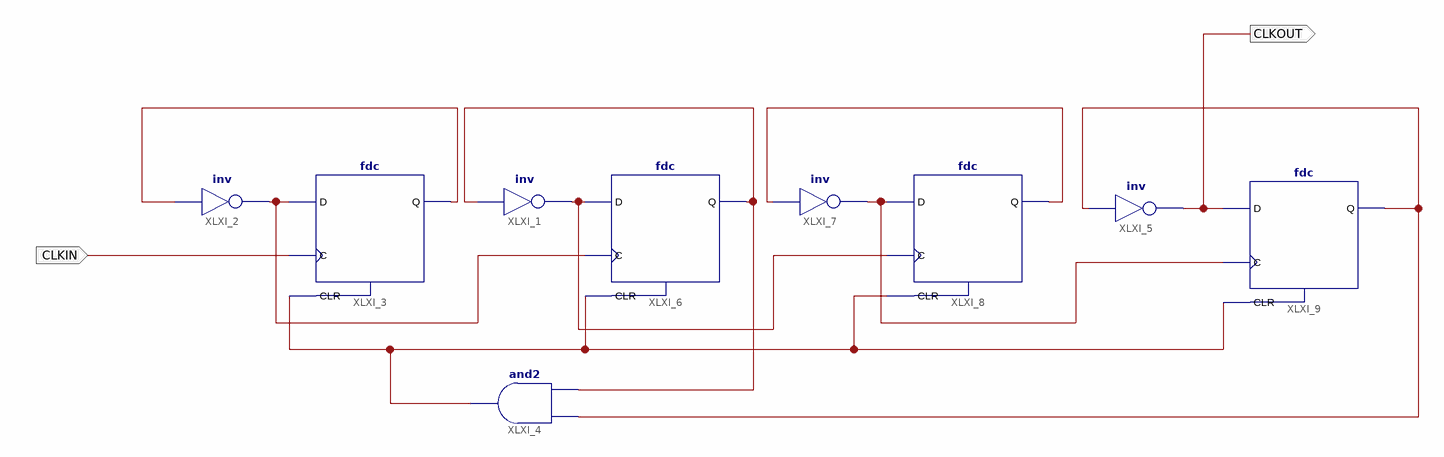
[diagram p0: schematic sheet 1]
// Xilinx ISE schematic C_DIV_10.sch (spartan6) as structural Verilog: 9 symbols, 2 ports
module C_DIV_10 (
  input  CLKIN,
  output CLKOUT
);

  wire XLXN_1, XLXN_2, XLXN_3, XLXN_4, XLXN_8, XLXN_13, XLXN_16, XLXN_17;

  not XLXI_1 (XLXN_2, XLXN_16);
  not XLXI_2 (XLXN_1, XLXN_17);
  fdc XLXI_3 (.C(CLKIN), .CLR(XLXN_4), .D(XLXN_1), .Q(XLXN_17));
  and XLXI_4 (XLXN_4, XLXN_16, XLXN_8);
  not XLXI_5 (CLKOUT, XLXN_8);
  fdc XLXI_6 (.C(XLXN_1), .CLR(XLXN_4), .D(XLXN_2), .Q(XLXN_16));
  not XLXI_7 (XLXN_3, XLXN_13);
  fdc XLXI_8 (.C(XLXN_2), .CLR(XLXN_4), .D(XLXN_3), .Q(XLXN_13));
  fdc XLXI_9 (.C(XLXN_3), .CLR(XLXN_4), .D(CLKOUT), .Q(XLXN_8));
endmodule
